# EAGLE design RPI_LoRa_v1 (EAGLE 8.7.0)
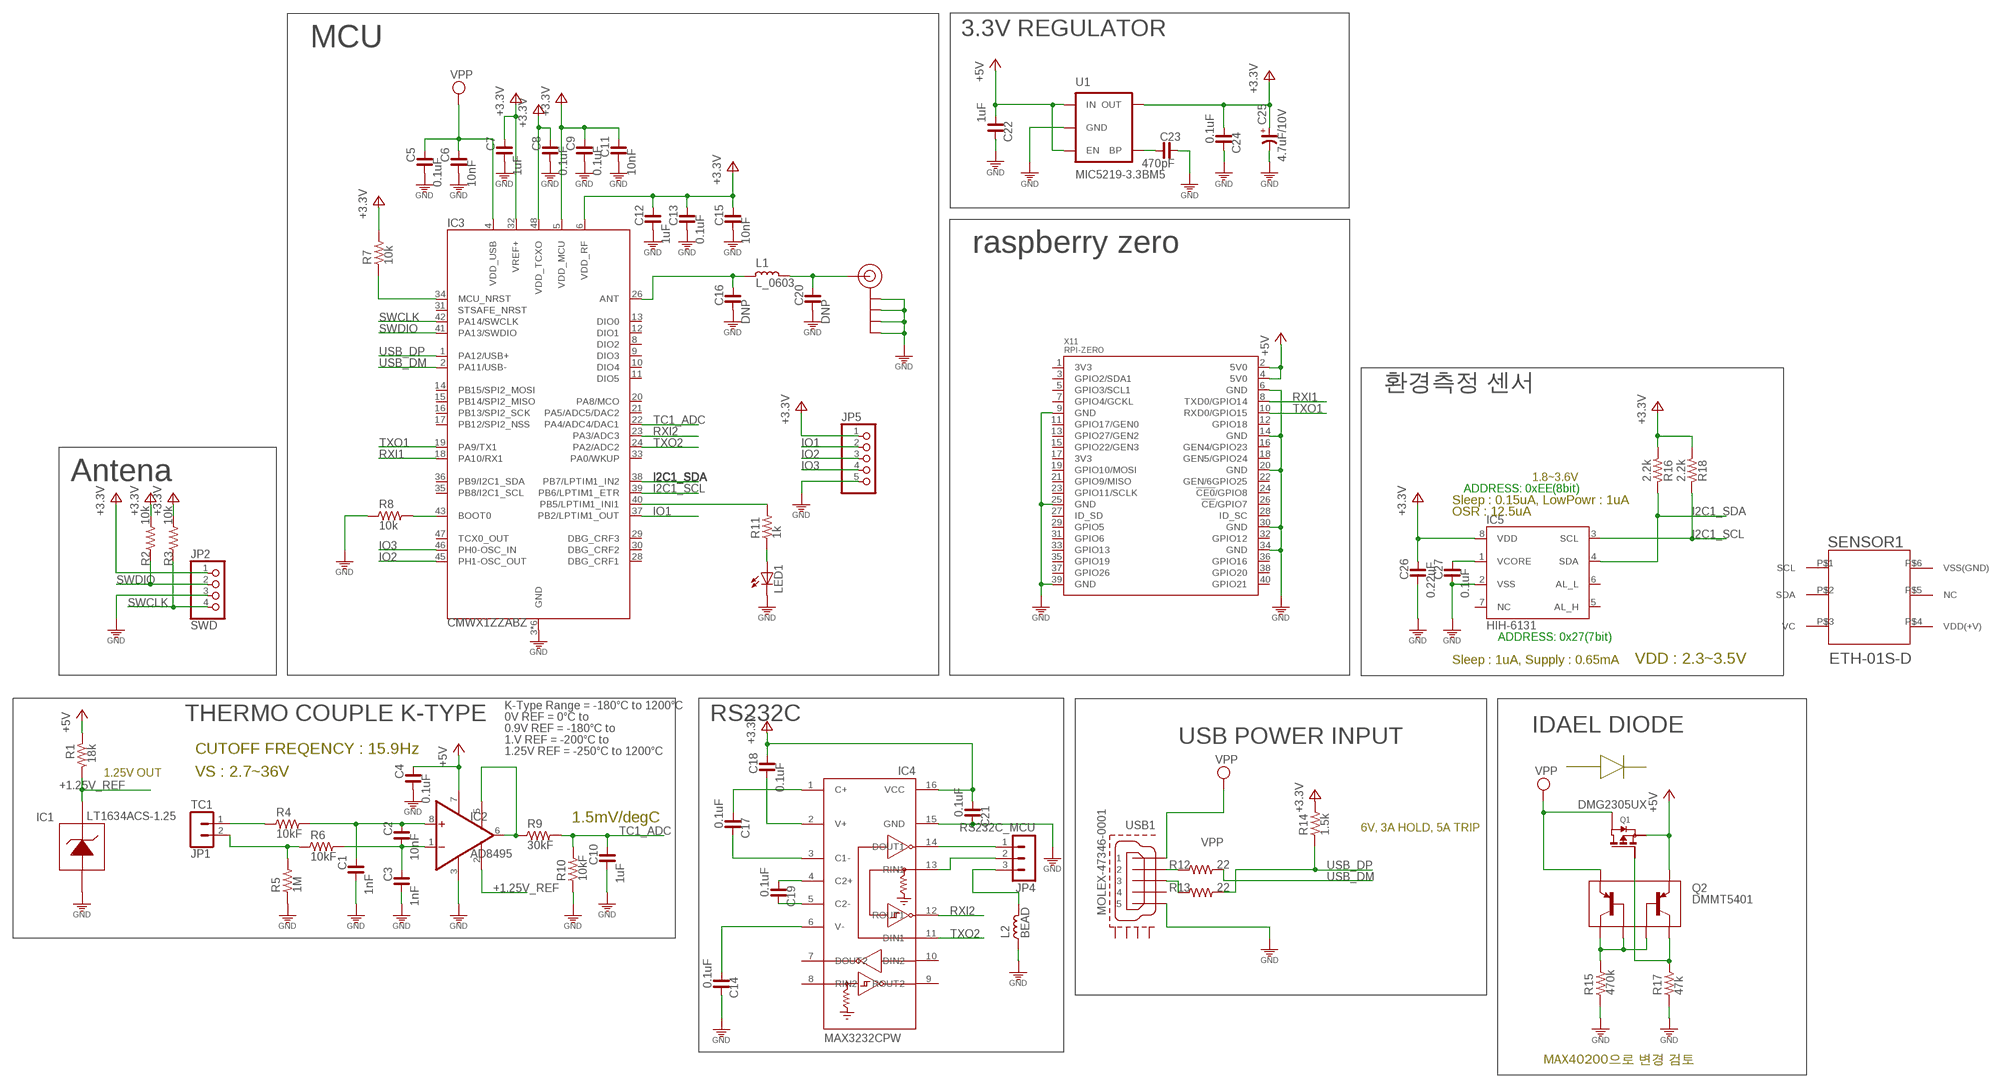
[diagram p0: schematic, sheet 1]

## Parts
C1  1nF  C_0603  [C0603]
C2  10nF  C_0603  [C0603]
C3  1nF  C_0603  [C0603]
C4  0.1uF  C_0603  [C0603]
C5  0.1uF  C_0603  [C0603]
C6  10nF  C_0603  [C0603]
C7  1uF  C_0603  [C0603]
C8  0.1uF  C_0603  [C0603]
C9  0.1uF  C_0603  [C0603]
C10  1uF  C_0603  [C0603]
C11  10nF  C_0603  [C0603]
C12  1uF  C_0603  [C0603]
C13  0.1uF  C_0603  [C0603]
C14  0.1uF  C_0603  [C0603]
C15  10nF  C_0603  [C0603]
C16  DNP  C_0603  [C0603]
C17  0.1uF  C_0603  [C0603]
C18  0.1uF  C_0603  [C0603]
C19  0.1uF  C_0603  [C0603]
C20  DNP  C_0603  [C0603]
C21  0.1uF  C_0603  [C0603]
C22  1uF  C_0603  [C0603]
C23  470pF  C_0603  [C0603]
C24  0.1uF  C_0603  [C0603]
C25  4.7uF/10V  CP_2012  [C2012/T]
C26  0.22uF  C_0603  [C0603]
C27  0.1uF  C_0603  [C0603]
IC1  LT1634ACS-1.25  LT1634MS8  [MS8]
IC2  AD8495  AD849X  [MSOP8]
IC3  CMWX1ZZABZ  [CMWX1ZZABZ]
IC4  MAX3232CPW  [PW_R-PDSO-G16]
IC5  HIH-6131  [SO08]
J$1  SMA_EDGE  [SMA-EDGE]
JP1  TC1  MA02ED350V-02P  [ED350V-02P]
JP2  SWD  PINHD-1X4M  [1X04M]
JP4  RS232C_MCU  MA03-15267  [MOLEX5267-03]
JP5  PINHD-1X55X2MM  [1_05X2MM]
L1  L_0603  [L0603]
L2  BEAD  L_0603  [L0603]
LED1  LEDSMD-1608  [LED-1608]
Q1  DMG2305UX  P-FET  [SOT23]
Q2  DMMT5401  [SOT23-6L]
R1  18k  R_0603  [R0603]
R2  10k  R_0603  [R0603]
R3  10k  R_0603  [R0603]
R4  10kF  R_0603  [R0603]
R5  1M  R_0603  [R0603]
R6  10kF  R_0603  [R0603]
R7  10k  R_0603  [R0603]
R8  10k  R_0603  [R0603]
R9  30kF  R_0603  [R0603]
R10  10kF  R_0603  [R0603]
R11  1k  R_0603  [R0603]
R12  22  R_0603  [R0603]
R13  22  R_0603  [R0603]
R14  1.5k  R_0603  [R0603]
R15  470k  R_0603  [R0603]
R16  2.2k  R_0603  [R0603]
R17  47k  R_0603  [R0603]
R18  2.2k  R_0603  [R0603]
SENSOR1  ETH-01S-D  [SENSOR]
U1  MIC5219-3.3BM5  V_REG_LDOSMD  [SOT23-5]
USB1  MOLEX-47346-0001  [MOLEX-47364-0001]
X11  RPI-ZERO  [RASP_PI_ZERO_BOARD_FULL]

## Nets
3V3: C7.1 C8.1 C9.1 C11.1 C12.1 C13.1 C15.1 C18.1 C21.2 C24.2 C25.+ C26.1 IC3.5(VDD_MCU) IC3.6(VDD_RF) IC3.32(VREF+) IC3.48(VDD_TCXO) IC4.16(VCC) IC5.8(VDD) JP2.1 JP5.1 R2.2 R3.2 R7.2 R14.2 R16.2 R18.2 U1.5(OUT) ; supply symbol labelled +3V3
+1.25V_REF: IC1.6(VOUT) IC2.2(REF) R1.2
+5V: C4.1 C22.2 IC2.7(V+) Q1.S(SOURCE) Q2.5(E2) R1.1 U1.1(IN) U1.3(EN) X11.2(5V0) X11.4(5V0)
ANTL: C20.1 J$1.SIG(SIGNAL) L1.1
GND: C1.2 C3.2 C4.2 C5.2 C6.2 C7.2 C8.2 C9.2 C10.2 C11.2 C12.2 C13.2 C14.1 C15.2 C16.2 C20.2 C21.1 C22.1 C23.1 C24.1 C25.- C26.2 C27.2 IC1.4(GND) IC2.3(V-) IC3.3(GND) IC3.7(GND) IC3.25(GND) IC3.27(GND) IC3.44(GND) IC3.PAD(GND) IC4.15(GND) IC5.2(VSS) J$1.GND@0(GND) J$1.GND@1(GND) J$1.GND@2(GND) J$1.GND@3(GND) JP2.3 JP5.5 L2.2 LED1.C R5.1 R8.1 R10.1 R15.1 R17.1 U1.2(GND) USB1.5 X11.6(GND) X11.9(GND) X11.14(GND) X11.20(GND) X11.25(GND) X11.30(GND) X11.34(GND) X11.39(GND)
I2C1_SCL: IC3.39(PB6/LPTIM1_ETR) IC5.3(SCL) R18.1
I2C1_SDA: IC3.38(PB7/LPTIM1_IN2) IC5.4(SDA) R16.1
IO1: IC3.37(PB2/LPTIM1_OUT) JP5.2
IO2: IC3.45(PH1-OSC_OUT) JP5.3
IO3: IC3.46(PH0-OSC_IN) JP5.4
N$1: C23.2 U1.4(BP)
N$2 [GND]: JP4.3 L2.1
N$3: R13.1 USB1.3
N$4: R12.1 USB1.2
N$5: Q1.G(GATE) Q2.4(C2) R17.2
N$6: LED1.A R11.1
N$7: IC3.34(MCU_NRST) R7.1
N$8: IC3.40(PB5/LPTIM1_INI1) R11.2
N$9: Q2.1(C1) Q2.2(B1) Q2.3(B2) R15.2
N$10: C27.1 IC5.1(VCORE)
N$14: C19.1 IC4.5(C2-)
N$15: C19.2 IC4.4(C2+)
N$16: C18.2 IC4.2(V+)
N$17: C16.1 IC3.26(ANT) L1.2
N$18: IC3.43(BOOT0) R8.2
N$26: C14.2 IC4.6(V-)
N$27: C17.2 IC4.1(C+)
N$29: C17.1 IC4.3(C1-)
N$36: IC4.13(RIN1) JP4.2
N$40: IC4.14(DOUT1) JP4.1
N$41: C2.2 C3.1 IC2.1(-IN) R6.2
N$42: C1.1 C2.1 IC2.8(+IN) R4.2
N$45: JP1.2 R5.2 R6.1
N$46: JP1.1 R4.1
N$47: IC2.5(SENS) IC2.6(OUT) R9.1
RXI1: IC3.18(PA10/RX1) X11.8(TXD0/GPIO14)
RXI2: IC3.23(PA3/ADC3) IC4.12(ROUT1)
SWCLK: IC3.42(PA14/SWCLK) JP2.4 R3.1
SWDIO: IC3.41(PA13/SWDIO) JP2.2 R2.1
TC1_ADC: C10.1 IC3.22(PA4/ADC4/DAC1) R9.2 R10.2
TXO1: IC3.19(PA9/TX1) X11.10(RXD0/GPIO15)
TXO2: IC3.24(PA2/ADC2) IC4.11(DIN1)
USB_DM: IC3.2(PA11/USB-) R12.2
USB_DP: IC3.1(PA12/USB+) R13.2 R14.1
VPP: C5.1 C6.1 IC3.4(VDD_USB) Q1.D(DRAIN) Q2.6(E1) USB1.1
Unconnected: IC3.8(DIO2) IC3.9(DIO3) IC3.10(DIO4) IC3.11(DIO5) IC3.12(DIO1) IC3.13(DIO0) IC3.14(PB15/SPI2_MOSI) IC3.15(PB14/SPI2_MISO) IC3.16(PB13/SPI2_SCK) IC3.17(PB12/SPI2_NSS) IC3.20(PA8/MCO) IC3.21(PA5/ADC5/DAC2) IC3.28(DBG_CRF1) IC3.29(DBG_CRF3) IC3.30(DBG_CRF2) IC3.31(STSAFE_NRST) IC3.33(PA0/WKUP) IC3.35(PB8/I2C1_SCL) IC3.36(PB9/I2C1_SDA) IC3.47(TCX0_OUT) IC4.7(DOUT2) IC4.8(RIN2) IC4.9(ROUT2) IC4.10(DIN2) IC5.5(AL_H) IC5.6(AL_L) IC5.7(NC) SENSOR1.P$1(SCL) SENSOR1.P$2(SDA) SENSOR1.P$3(VC) SENSOR1.P$4(VDD(+V)) SENSOR1.P$5(NC) USB1.4 USB1.GND1 USB1.GND2 USB1.GND3 USB1.GND4 X11.1(3V3) X11.3(GPIO2/SDA1) X11.5(GPIO3/SCL1) X11.7(GPIO4/GCKL) X11.11(GPIO17/GEN0) X11.12(GPIO18) X11.13(GPIO27/GEN2) X11.15(GPIO22/GEN3) X11.16(GEN4/GPIO23) X11.17(3V3) X11.18(GEN5/GPIO24) X11.19(GPIO10/MOSI) X11.21(GPIO9/MISO) X11.22(GEN/6GPIO25) X11.23(GPIO11/SCLK) X11.24(!CE0!/GPIO8) X11.26(!CE!/GPIO7) X11.27(ID_SD) X11.28(ID_SC) X11.29(GPIO5) X11.31(GPIO6) X11.32(GPIO12) X11.33(GPIO13) X11.35(GPIO19) X11.36(GPIO16) X11.37(GPIO26) X11.38(GPIO20) X11.40(GPIO21)

## Notes on the sheet
- 3.3V REGULATOR
- MCU
- raspberry zero
- 환경측정 센서
- Antena | 1.8~3.6V
- ADDRESS: 0xEE(8bit)
- Sleep : 0.15uA, LowPowr : 1uA
- OSR : 12.5uA
- ADDRESS: 0x27(7bit)
- Sleep : 1uA, Supply : 0.65mA | VDD : 2.3~3.5V
- K-Type Range = -180°C to 1200°C
- THERMO COUPLE K-TYPE | 0V REF = 0°C to | RS232C
- 0.9V REF = -180°C to | IDAEL DIODE
- 1.V REF = -200°C to | USB POWER INPUT
- CUTOFF FREQENCY : 15.9Hz | 1.25V REF = -250°C to 1200°C
- 1.25V OUT | VS : 2.7~36V
- 1.5mV/degC | 6V, 3A HOLD, 5A TRIP
- MAX40200으로 변경 검토

## Power pins joined to a net without a drawn wire
VSS(GND): SENSOR1.P$6(VSS(GND))

## Library data of the parts
C1-C24 C26 C27 = cona_lib:C_: NON-POLARIZED CAP
C25 = cona_lib:CP_: POLARIZED CAP
IC1 = cona_lib:LT1634: Initial Voltage Accuracy: 0.05% n Low Operating Current: 10µA n Low Drift: 10ppm/°C Max n Less Than 1Ω Dynamic Impedance n Both Commercial and Industrial Temperature Range Parts Are Available n Available in 1.25V, 2.5V, 4.096V and 5V in SO-8 and TO-92 Packages n 1.25V and 2.5V Available in MSOP Package
IC2 = cona_lib:AD849X
IC3 = cona_lib:CMWX1ZZABZ
IC4 = cona_lib:MAX3232: TI
IC5 = cona_lib:HIH-6131
J$1 = 3DRobotics:SMA_EDGE: SMA Antenna Connector End launch SMA connector. The paste layer has been removed so that the connector can be hand soldered onto the board after reflow.
JP1 = cona_lib:MA02
JP2 = pinhead:PINHD-1X4: PIN HEADER
JP4 = cona_lib:MA03-1: PIN HEADER
JP5 = pinhead:PINHD-1X5: PIN HEADER
L1 L2 = cona_lib:L_: INDUCTOR
LED1 = cona_lib:LED: LED OSRAM: - CHIPLED LG R971, LG N971, LY N971, LG Q971, LY Q971, LO R971, LY R971 LH N974, LH R974 LS Q976, LO Q976, LY Q976 LO Q996 - Hyper CHIPLED LW Q18S LB Q993, LB Q99A, LB R99A - SideLED LS A670, LO A670, LY A670, LG A670, LP A670 LB A673, LV A673, LT A673, LW A673 LH A674 LY A675 LS A676, LA A676, LO A676, LY A676, LW A676 LS A679, LY A679, LG A679 - Hyper Micro SIDELED® LS Y876, LA Y876, LO Y876, LY Y876 LT Y87S - SmartLED LW L88C, LW L88S LB L89C, LB L89S, LG L890 LS L89K, LO L89K, LY L89K LS L896, LA L896, LO L896, LY L896 - TOPLED LS T670, LO T670, LY T670, LG T670, LP T670 LSG T670, LSP T670, LSY T670, LOP T670, LYG T670 LG T671, LOG T671, LSG T671 LB T673, LV T673, LT T673, LW T673 LH T674 LS T676, LA T676, LO T676, LY T676, LB T676, LH T676, LSB T676, LW T676 LB T67C, LV T67C, LT T67C, LS T67K, LO T67K, LY T67K, LW E67C LS E67B, LA E67B, LO E67B, LY E67B, LB E67C, LV E67C, LT E67C LW T67C LS T679, LY T679, LG T679 LS T770, LO T770, LY T770, LG T770, LP T770 LB T773, LV T773, LT T773, LW T773 LH T774 LS E675, LA E675, LY E675, LS T675 LS T776, LA T776, LO T776, LY T776, LB T776 LHGB T686 LT T68C, LB T68C - Hyper Mini TOPLED® LB M676 - Mini TOPLED Santana® LG M470 LS M47K, LO M47K, LY M47K Source: http://www.osram.convergy.de LUXEON: - LUMILED® LXK2-PW12-R00, LXK2-PW12-S00, LXK2-PW14-U00, LXK2-PW14-V00 LXK2-PM12-R00, LXK2-PM12-S00, LXK2-PM14-U00 LXK2-PE12-Q00, LXK2-PE12-R00, LXK2-PE12-S00, LXK2-PE14-T00, LXK2-PE14-U00 LXK2-PB12-K00, LXK2-PB12-L00, LXK2-PB12-M00, LXK2-PB14-N00, LXK2-PB14-P00, LXK2-PB14-Q00 LXK2-PR12-L00, LXK2-PR12-M00, LXK2-PR14-Q00, LXK2-PR14-R00 LXK2-PD12-Q00, LXK2-PD12-R00, LXK2-PD12-S00 LXK2-PH12-R00, LXK2-PH12-S00 LXK2-PL12-P00, LXK2-PL12-Q00, LXK2-PL12-R00 Source: www.luxeon.com KINGBRIGHT: KA-3528ASYC Source: www.kingbright.com
Q1 = cona_lib:P-FET
Q2 = cona_lib:DMMT5401
R1-R18 = cona_lib:R_: RESISTOR
SENSOR1 = ETH-01S-D:ETH-01S-D
U1 = SparkFun:V_REG_LDO: Voltage Regulator LDO Standard 150mA LDO voltage regulator in SOT-23 layout. Micrel part MIC5205. BP (by-pass) pin is used to lower output noise with 470pF cap.
USB1 = usb_con-update:MOLEX-47346-0001: MICRO USB B, BOTTOM MOUNT
X11 = rpi-zero:RPI-ZERO

## Net classes
0 default: clearance 0.152 mm
2 GND: width 0.406 mm, clearance 0.152 mm

## Board
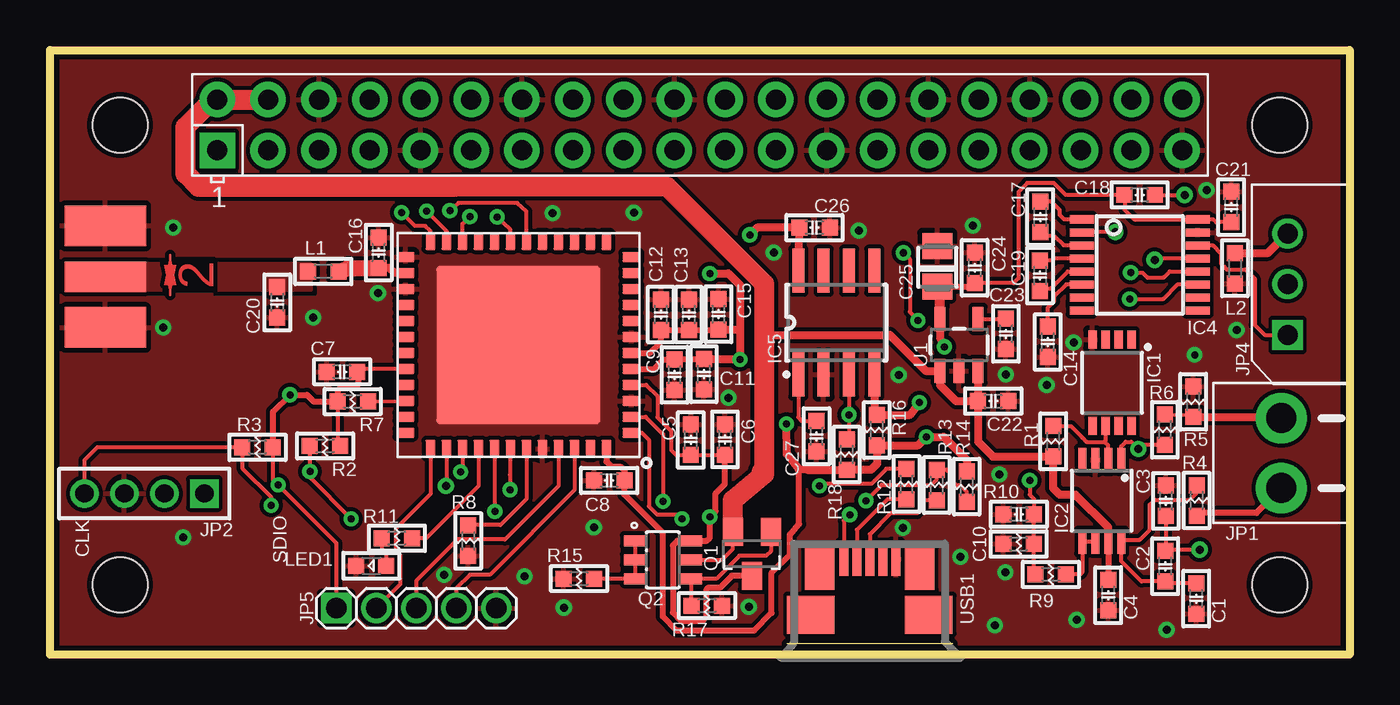
[diagram p1: board, top side]
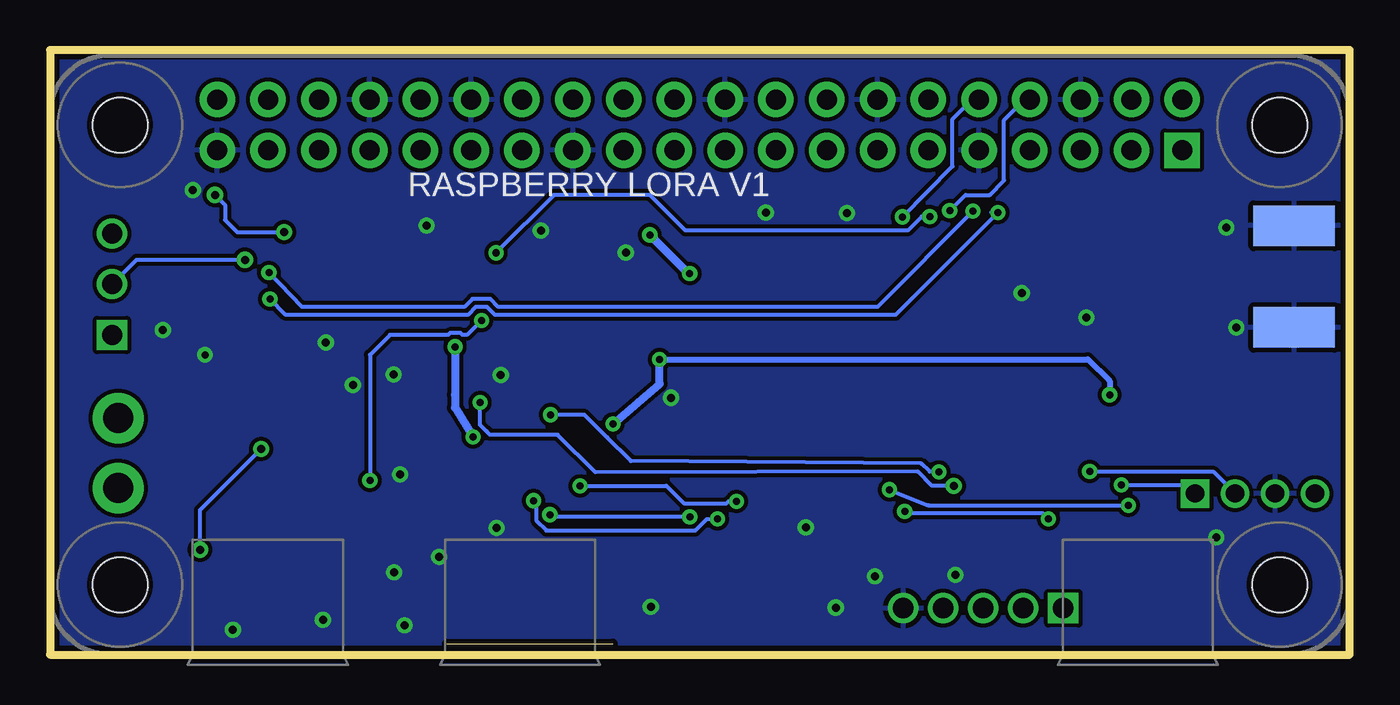
[diagram p2: board, bottom side, seen from below]

Size 65 x 30.25 mm. Coordinates in mm from the lower left corner, seen from the top.
Outline: 0,30.25 65,30.25 65,0 0,0 0,30.25
Copper layers (1*16): Top 0.035mm / dielectric 1.5mm / Bottom 0.035mm
Design rules "KHC_mm": minimum track width 0.2mm, minimum drill 0.3mm, track to track 0.2mm, track to pad 0.2mm, pad to pad 0.2mm, via to via 0.2mm, smd to smd 0.2mm, copper to edge 10mil, drill to drill 0.2mm, minimum pad ring 10mil, minimum via ring 8mil, stop-mask expansion 4mil, vias tented up to drill 0mil, thermal gap 10mil

### Footprints (pad centres in the part's own frame; a part is rotated, then mirrored left to right if it is on the bottom)
C0603 = smd 0.8 x 0.8: 1 -0.762,0; 2 0.762,0
C2012/T = smd 1.3 x 1.5: + 1.016,0; - -1.016,0
MS8 = smd 0.42 x 0.899: 1 -0.975,-2.166; 2 -0.325,-2.166; 3 0.325,-2.166; 4 0.975,-2.166; 5 0.975,2.166; 6 0.325,2.166; 7 -0.325,2.166; 8 -0.975,2.166
MSOP8 = smd 0.4 x 1.2: 1 -0.975,-2.05; 2 -0.325,-2.05; 3 0.325,-2.05; 4 0.975,-2.05; 5 0.975,2.05; 6 0.325,2.05; 7 -0.325,2.05; 8 -0.975,2.05
CMWX1ZZABZ = smd 0.9 x 0.5: 1 -5.65,4.4; 2 -5.65,3.6; 3 -5.65,2.8; 4 -5.65,2; 5 -5.65,1.2; 6 -5.65,0.4; 7 -5.65,-0.4; 8 -5.65,-1.2; 9 -5.65,-2; 10 -5.65,-2.8; 11 -5.65,-3.6; 12 -5.65,-4.4; 25 5.65,-4.4; 26 5.65,-3.6; 27 5.65,-2.8; 28 5.65,-2; 29 5.65,-1.2; 30 5.65,-0.4; 31 5.65,0.4; 32 5.65,1.2; 33 5.65,2; 34 5.65,2.8; 35 5.65,3.6; 36 5.65,4.4 | smd 0.5 x 0.9: 13 -4.4,-5.2; 14 -3.6,-5.2; 15 -2.8,-5.2; 16 -2,-5.2; 17 -1.2,-5.2; 18 -0.4,-5.2; 19 0.4,-5.2; 20 1.2,-5.2; 21 2,-5.2; 22 2.8,-5.2; 23 3.6,-5.2; 24 4.4,-5.2; 37 4.4,5.2; 38 3.6,5.2; 39 2.8,5.2; 40 2,5.2; 41 1.2,5.2; 42 0.4,5.2; 43 -0.4,5.2; 44 -1.2,5.2; 45 -2,5.2; 46 -2.8,5.2; 47 -3.6,5.2; 48 -4.4,5.2 | smd 8.2 x 7.9: PAD 0,0
PW_R-PDSO-G16 = smd 0.4 x 1.2: 1 -2.275,-2.9; 2 -1.625,-2.9; 3 -0.975,-2.9; 4 -0.325,-2.9; 5 0.325,-2.9; 6 0.975,-2.9; 7 1.625,-2.9; 8 2.275,-2.9; 9 2.275,2.9; 10 1.625,2.9; 11 0.975,2.9; 12 0.325,2.9; 13 -0.325,2.9; 14 -0.975,2.9; 15 -1.625,2.9; 16 -2.275,2.9
SO08 = smd 0.6 x 2.2: 1 -1.905,-2.6; 2 -0.635,-2.6; 3 0.635,-2.6; 4 1.905,-2.6; 5 1.905,2.6; 6 0.635,2.6; 7 -0.635,2.6; 8 -1.905,2.6
SMA-EDGE = smd 2.032 x 4.064: GND@0 -2.54,0; GND@1 2.54,0 | smd 2.032 x 4.064 bottom: GND@2 -2.54,0; GND@3 2.54,0 | smd 1.524 x 4.064: SIG 0,0
ED350V-02P = drill 1.5 pad 2.54: 1 -1.75,0; 2 1.75,0
1X04M = drill 0.914 square: 1 -3,0 | drill 0.914: 2 -1,0; 3 1,0; 4 3,0
MOLEX5267-03 = drill 1 square: 1 -2.54,0 | drill 1: 2 0,0; 3 2.54,0
1_05X2MM = drill 1.016 pad 1.3 square: 1 -4,0 | drill 1.016 pad 1.3: 2 -2,0; 3 0,0; 4 2,0; 5 4,0
L0603 = smd 0.8 x 0.8: 1 -0.762,0; 2 0.762,0
LED-1608 = smd 0.8 x 0.8: A -0.75,0; C 0.75,0
SOT23 = smd 1 x 1.4: D 0,-1.1; G 0.95,1.1; S -0.95,1.1
SOT23-6L = smd 0.55 x 1.1: 1 -0.95,-1.4; 2 0,-1.4; 3 0.95,-1.4; 4 0.95,1.4; 5 0,1.4; 6 -0.95,1.4
R0603 = smd 0.8 x 0.8: 1 -0.762,0; 2 0.762,0
SENSOR = smd 0.82 x 0.5: P$1 0.1,-0.55; P$2 0.1,-1.5; P$3 0.1,-2.45; P$4 2.31,-0.55; P$5 2.31,-1.5; P$6 2.31,-2.45
SOT23-5 = smd 0.55 x 1.2: 1 -0.95,-1.3; 2 0,-1.3; 3 0.95,-1.3; 4 0.95,1.3; 5 -0.95,1.3
MOLEX-47364-0001 = smd 1.7 x 0.45: 1 2.8,1.3; 2 2.8,0.65; 3 2.8,0; 4 2.8,-0.65; 5 2.8,-1.3 | smd 1.9 x 2.375: GND1 0,2.95; GND4 0,-2.95 | smd 2.1 x 1.475: GND2 2.3,2.5; GND3 2.3,-2.5
RASP_PI_ZERO_BOARD_FULL = drill 1 pad 1.778 square: 1 8.37,25.23 | drill 1 pad 1.778: 2 8.37,27.77; 3 10.91,25.23; 4 10.91,27.77; 5 13.45,25.23; 6 13.45,27.77; 7 15.99,25.23; 8 15.99,27.77; 9 18.53,25.23; 10 18.53,27.77; 11 21.07,25.23; 12 21.07,27.77; 13 23.61,25.23; 14 23.61,27.77; 15 26.15,25.23; 16 26.15,27.77; 17 28.69,25.23; 18 28.69,27.77; 19 31.23,25.23; 20 31.23,27.77; 21 33.77,25.23; 22 33.77,27.77; 23 36.31,25.23; 24 36.31,27.77; 25 38.85,25.23; 26 38.85,27.77; 27 41.39,25.23; 28 41.39,27.77; 29 43.93,25.23; 30 43.93,27.77; 31 46.47,25.23; 32 46.47,27.77; 33 49.01,25.23; 34 49.01,27.77; 35 51.55,25.23; 36 51.55,27.77; 37 54.09,25.23; 38 54.09,27.77; 39 56.63,25.23; 40 56.63,27.77 | hole 2.75: 3.5,3.5; 3.5,26.5; 61.5,3.5; 61.5,26.5

### Placement (x,y rotation side)
C1  57.33,2.8 270 top
C2  55.78,4.42 90 top
C3  55.81,7.69 90 top
C4  52.93,2.97 270 top
C5  32.05,10.74 90 top
C6  33.76,10.76 90 top
C7  14.61,14.15 180 top
C8  27.97,8.71 180 top
C9  31.24,14 270 top
C10  48.46,7.02 180 top
C11  32.7,14.03 270 top
C12  30.55,17.01 90 top
C13  31.95,17.01 90 top
C14  49.9,15.64 90 top
C15  33.44,17.03 90 top
C16  16.44,20.11 90 top
C17  49.53,21.89 90 top
C18  54.5,23 0 top
C19  49.52,18.96 90 top
C20  11.37,17.62 270 top
C21  59.08,22.39 270 top
C22  47.18,12.68 180 top
C23  47.81,16.05 90 top
C24  46.25,19.35 270 top
C25  44.38,19.43 270 top
C26  38.24,21.36 0 top
C27  38.34,10.92 270 top
IC1  53.12,13.6 180 top
IC2  52.6,7.7 180 top
IC3  23.43,15.49 180 top
IC4  54.5,19.5 270 top
IC5  39.33,16.61 0 top
J$1  2.77,18.91 90 top
JP1  61.59,10.08 90 top
JP2  4.72,8.06 180 top
JP4  61.9,18.53 90 top
JP5  18.32,2.32 0 top
L1  13.67,19.17 0 top
L2  59.27,19.33 270 top
LED1  16.07,4.45 180 top
Q1  35.1,5.04 0 top
Q2  30.65,4.74 270 top
R1  50.18,10.67 90 top
R2  13.76,10.44 0 top
R3  10.38,10.37 0 top
R4  57.35,7.71 90 top
R5  57.18,12.65 270 top
R6  55.76,11.25 270 top
R7  15.14,12.66 180 top
R8  20.92,5.69 90 top
R9  50.06,4.01 180 top
R10  48.45,5.53 0 top
R11  17.35,5.82 0 top
R12  42.84,8.53 90 top
R13  44.35,8.48 90 top
R14  45.85,8.4 90 top
R15  26.46,3.8 0 top
R16  41.35,11.23 270 top
R17  32.86,2.45 180 top
R18  39.85,10.01 270 top
SENSOR1  -4,-6.5 0 top  (outside the outline)
U1  45.47,15.49 0 top
USB1  41,2 90 top
X11  0,0 0 top

### Tracks (layer width: path | path; a pad name or v marks a point on that pad's centre or on a via)
3V3  (via drill 0.35)
  Top 0.2: R7.2 14.38,10.58 R2.2 | C21.2 58.33,21.63 58.19,21.77 IC4.16 54.23,21.77 53.75,22.25 53.75,22.99 C18.1 50.8,23 50.21,23.59 48.88,23.59 48.44,23.15 48.44,18.83 48.19,18.58 48.18,18.59 C24.2 | IC3.32 15.51,14.29 15.45,14.22 C7.1 | 11.15,10.97 11.15,10.96 11.14,10.95 R3.2 11.14,8.76 v11.42,8.48 14.32,5.58 JP5.1
  Top 0.3: IC3.6 30.02,15.09 30.55,15.62 C12.1 C13.1 33.42,16.25 C15.1 | C11.1 32.67,14.76 C9.1 30.69,14.76 30.22,14.29 IC3.5 | R18.2 40.1,9 | C25.+ 46.08,18.41 C24.2 | 15.45,14.22 15.44,13.55 15.25,13.39 14.54,13.38 14.41,13.19 R7.2 13.22,12.66 13.21,12.65 12.86,13 v12,13 11.14,12.14 R3.2 | IC3.48 27.83,9.66 28.08,9.41 28.53,9.41 28.73,9.21 C8.1 28.73,8.01 30.65,6.09 30.65,1.9 31.35,1.2 35.22,1.2 36.09,2.08 36.09,4.09 37,5 37,6 37.47,6.53 37.46,9.25
  Top 0.4: IC5.8 C26.1 35.36,21.36 v35,21 | U1.5 44.52,15.85 v44.73,15.4 | 41.42,10.13 R16.2 | R16.2 41.37,9.54 41.07,9.24 R18.2 37.88,9.25 37.46,9.25 36.85,10.03 v36.83,11.54 | 33.42,16.25 | C11.1 34.49,14.79 v34.52,14.77 34.51,16.24 | C15.1 34.48,16.27 34.51,16.24 | v33,19.07 33.93,19.07 34.51,18.49 34.51,16.24 | R16.2 43.42,10.47 v43.84,10.89 44.7,10.89 45.85,9.74 R14.2
  Top 0.5: U1.5 44.52,18.27 C25.+
  Bottom 0.2: v11.42,8.48 8.14,8.48 JP2.1
  Bottom 0.3: v34.52,14.77 13.09,14.77 12,13.68 v12,13
  Bottom 0.4: v44.73,15.4 44.74,13 44.74,12.36 v43.84,10.89 | v36.83,11.54 34.51,13.54 v34.52,14.77 | v35,21 33.07,19.07 v33,19.07
+1.25V_REF
  Top 0.2: R1.2 51.07,11.43 51.63,10.87 51.63,10.86 51.85,10.65 52.74,10.65 | IC1.6 52.8,10.71 52.74,10.65 | IC2.2 52.92,10.46 52.74,10.65
+5V
  Top 0.2: Q2.5 33.6,4.74 34.15,5.29 Q1.S
  Top 0.3: IC2.7 C4.1
  Top 0.4: 46.44,14.17 U1.3 C22.2 | IC2.7 52.92,6.37 51.29,8 50.5,8 50.18,8.32 R1.1 47.16,9.91 46.42,10.65 C22.2 | 35.72,16 42,16 43.81,14.19 U1.1 44.52,13.48 45.32,12.68 C22.2
  Top 1: X11.4 X11.2 8.14,27.77 6.78,26.41 6.78,24.05 7.43,23.4 20.14,23.4 20.16,23.42 20.28,23.41 30.86,23.41 35.72,18.55 35.72,16 35.72,9.02 | Q1.S 34.15,7.72 35.72,9.02 | 35.72,9.02 35.6,9.14
ANTL
  Top 0.6: 2.86,19 J$1.SIG
  Top 0.8: 3.11,18.75 2.86,19
  pour Top (no thermals): 4.07,19.57 13.02,19.56 13.04,18.25 4.05,18.25
GND  (via drill 0.35, 0.4)
  other vias: 16.4,18.09 33.93,12.85 40.45,21.21 51.35,1.74 55.85,1.24 59.35,16.24 49.85,13.49 57.85,23.24 47.82,14.02 34.95,2.38 51.2,15.62 47.79,4.12 47.27,1.47 19.71,3.98 46.17,21.47 57.25,15 25.14,22.08 29.2,22.12 27.2,6.36 45.53,4.89 25.7,2.35 23.73,3.92 36.2,20.12 42.45,13.98 47.48,9.02 42.66,6.34 13.17,16.86 6.17,21.36 5.67,16.36 6.67,5.86
  pour Top (rank 3): 0,30.25 65,30.25 65,0 0,0
  pour Bottom: 0,30.25 65,30.25 65,-0.25 0,-0.25
I2C1_SCL  (via drill 0.35)
  Top 0.2: 39.76,10.86 R18.1 39.97,10.89 v39.97,12 IC5.3 | IC3.39 20.63,9.28 v20.53,9.14
  Bottom 0.2: v20.53,9.14 20.99,9.16 21.42,9.56 35.95,9.68 37.13,10.87 38.27,12 v39.97,12
I2C1_SDA  (via drill 0.35, 0.4)
  Top 0.2: 41.23,11.84 R16.1 | IC3.38 19.83,8.47 v19.8,8.44
  Top 0.4: IC5.4 41.23,12.11 R16.1 43.02,12 v43.49,12.62
  Bottom 0.2: v19.8,8.44 20.89,8.45 21.59,9.15 37.72,9.11 39.61,11 43,11 43.16,11.16 43.16,11.17 43.49,11.5 v43.49,12.62
IO1
  Top 0.2: IC3.37 19.03,8.03 17.29,6.29 17.29,5.21 17.52,4.97 17.52,3.52 JP5.2
IO2
  Top 0.2: IC3.45 25.43,8.43 22.75,5.75 20.39,5.75 18.32,3.68 JP5.3
IO3
  Top 0.2: IC3.46 26.23,8.23 22,4 21,4 20.32,3.32 JP5.4
N$1
  Top 0.2: U1.4 47.84,16.79 C23.2
N$2
  Top 0.4: L2.1 60.92,20.09 JP4.3
N$3
  Top 0.2: USB1.3 41,6.02 42.05,7.07 43.36,7.07 43.54,7.24 43.54,7.55 43.71,7.72 R13.1
N$4
  Top 0.2: USB1.2 40.36,6.24 41.89,7.77 R12.1
N$5
  Top 0.2: Q1.G 36.05,5.17 35.82,4.94 34.48,4.94 33.33,3.79 Q2.4 32.05,2.5 R17.2
N$6
  Top 0.2: R11.1 16.59,5.3 16.82,5.07 LED1.A
N$7
  Top 0.2: R7.1 IC3.34
N$8
  Top 0.2: IC3.40 21.43,8.43 18.82,5.82 R11.2
N$9
  Top 0.2: R15.2 27.49,3.79 Q2.3 Q2.2 Q2.1
N$10
  Top 0.2: IC5.1 37.42,11.87 37.59,11.7 38.32,11.7 C27.1
N$14
  Top 0.2: IC4.5 50.91,19.18 50.05,18.32 49.82,18.32 49.82,18.2 C19.1
N$15
  Top 0.2: IC4.4 50.27,19.82 50.17,19.72 C19.2
N$16  (via drill 0.4)
  Top 0.2: C18.2 v56.75,23 | v53.28,21.13 IC4.2
  Bottom 0.2: v56.75,23 56.25,22.5 56.25,21.75 55.63,21.13 v53.28,21.13
N$17
  Top 0.4: IC3.26 17.23,19.09 16.97,19.35 C16.1
  Top 0.8: L1.2 14.93,19.35 C16.1
N$18
  Top 0.2: R8.2 20.95,6.48 22.53,6.48 23.83,7.78 IC3.43
N$26
  Top 0.2: C14.2 49.9,17.35 50.22,17.67 50.22,17.92 50.83,18.52 IC4.6
N$27
  Top 0.2: IC4.1 50.73,21.77 50.5,22 50.5,22.25 50.1,22.65 C17.2
N$29
  Top 0.2: C17.1 49.7,20.96 50.22,20.96 50.7,20.48 IC4.3
N$36  (via drill 0.4)
  Top 0.2: IC4.13 55.33,19.82 v55.25,19.75
  Bottom 0.2: v55.25,19.75 60.68,19.75 JP4.2
N$40
  Top 0.2: JP4.1 60.76,15.99 60.25,16.5 60.25,18.81 59.79,19.27 58.87,19.27 58.75,19.39 58.57,19.57 58.57,20.06 58.16,20.48 IC4.14
N$41  (via drill 0.4)
  Top 0.2: R6.2 55.67,10.5 54.5,10.5 54.37,10.37 | C3.1 55.81,5.21 | 55.81,5.21 C2.2 | v57.5,5.25 55.85,5.25 55.81,5.21 | IC2.1 53.58,10.41 53.81,10.65 54.08,10.65 54.37,10.37 | 54.37,10.37 v54.44,10.29
  Bottom 0.2: v57.5,5.25 57.5,7.23 v54.44,10.29
N$42
  Top 0.2: C1.1 55.88,3.56 C2.1 54.59,3.66 53.58,4.67 IC2.8 53.67,5.75 54.5,5.75 55,6.25 55,7.5 55.25,7.75 57,7.75 57.35,8.1 R4.2
N$45
  Top 0.2: R6.1 57.08,11.99 R5.2
  Top 0.4: R5.2 61.53,11.89 JP1.2
N$46
  Top 0.3: JP1.1 60.34,7.08 57.48,7.08 R4.1
N$47
  Top 0.2: IC2.6 IC2.5 51.62,4.12 51.5,4 51.49,4.01 R9.1
RXI1  (via drill 0.35)
  Top 0.2: IC3.18 23.83,22.17 23.37,22.6 20.44,22.6 v20,22.21
  Bottom 0.2: v20,22.21 19.21,23 18,23 17.28,23.72 17.28,26.75 16.26,27.77 X11.8
RXI2  (via drill 0.35)
  Top 0.2: v18.83,22.18 19.83,21.18 IC3.23 | v54.05,19.11 54.64,19.11 54.89,18.86 54.9,18.87 55.7,18.87 56.01,19.18 IC4.12
  Bottom 0.2: v18.83,22.18 23.61,17.4 42.58,17.4 42.97,17.8 43.87,17.8 44.27,17.4 52.4,17.4 v54.05,19.11
SWCLK  (via drill 0.35)
  Top 0.2: v11.06,7.47 11.06,7.88 9.62,9.32 R3.1 2.37,10.37 1.72,9.72 JP2.4 | IC3.42 23,10.26 23,9 v23,8.25
  Bottom 0.2: v23,8.25 21.05,7.47 v11.06,7.47
SWDIO  (via drill 0.35)
  Top 0.2: R2.1 v13,9.16 13,8.85 v15.06,6.79 | IC3.41 22.23,7.18 v22.25,7.16
  Bottom 0.2: v15.06,6.79 15.34,7.07 22.16,7.07 v22.25,7.16 | JP2.2 6.82,9.16 v13,9.16
TC1_ADC  (via drill 0.35)
  Top 0.2: R9.2 49.21,4.1 R10.2 49.22,5.54 C10.1 49.22,7.78 49,8 v49,8.71 | IC3.22 20.63,21.55 v21,21.92 | v42.69,20.1 43,19.79 43,17.14 v43.42,16.72
  Bottom 0.2: v21,21.92 21.39,21.92 22.09,21.22 33.22,21.22 35,23 39.79,23 v42.69,20.1 | v43.42,16.72 44.14,16 44.37,16 44.45,16.08 45.01,16.08 45.09,16 48,16 49,15 v49,8.71
TXO1  (via drill 0.35)
  Top 0.2: IC3.19 23.03,21.26 v22.37,21.9
  Bottom 0.2: v22.37,21.9 19.86,24.43 19.86,26.79 18.88,27.77 X11.10
TXO2  (via drill 0.35)
  Top 0.2: IC3.24 19.03,21.19 18.77,21.45 18.26,21.45 v17.59,22.12 | v54,17.79 55.68,17.79 56.42,18.53 IC4.11
  Bottom 0.2: 17.93,22.12 v17.59,22.12 22.71,17 42.74,17 43.14,17.4 43.7,17.4 44.1,17 53.21,17 v54,17.79 53.8,17.99
USB_DM  (via drill 0.35)
  Top 0.2: IC3.2 29.79,11.89 30.67,11.01 v30.67,7.67 | R12.2 41.84,9.29 41.09,8.55 38.6,8.55 v38.48,8.43
  Bottom 0.2: v38.48,8.43 34.16,8.44 33.29,7.57 31.16,7.57 31.06,7.67 v30.67,7.67
USB_DP  (via drill 0.35)
  Top 0.2: v31.61,6.78 31.4,6.99 30.39,6.99 29.95,7.42 29.95,10.75 29.61,11.09 IC3.1 | v40.81,7.7 41.61,8.5 44.08,8.5 44.35,8.77 R13.2 44.85,9.24 45.06,9.03 45.06,8.73 45.33,8.46 45.54,8.46 45.85,8.15 R14.1
  Bottom 0.2: v40.81,7.7 40.68,7.57 40.68,6.72 40.17,6.21 32.72,6.21 32.15,6.78 v31.61,6.78
VPP  (via drill 0.35)
  Top 0.2: v40,7 39.7,6.7 USB1.1 | C6.1 32.07,10 C5.1 31.32,9.98 31.07,10.23 31.07,11.18 30.38,11.87 30.38,12.93 29.82,13.49 IC3.4
  Top 0.3: Q1.D 34.11,3.94 33.51,3.34 32.92,3.34 32.85,3.27 32.85,1.91 32.64,1.7 31.55,1.7 31.15,2.1 31.15,5.46 31.38,5.69 Q2.6 32.84,5.69 33,5.85 v33,6.89 33.3,7.19 33.3,8.07 33.76,8.54 C6.1
  Bottom 0.2: v33,6.89 39.89,6.89 v40,7
(copper drawn outside any net)
  shapes: Top area x1

### Text on the board
_tPlace: CLK | SDIO
_bPlace: RASPBERRY LORA V1
201bmp: D:/TK/TK_LOGO.bmp